# EAGLE schematic multiplexer (EAGLE 6.3)
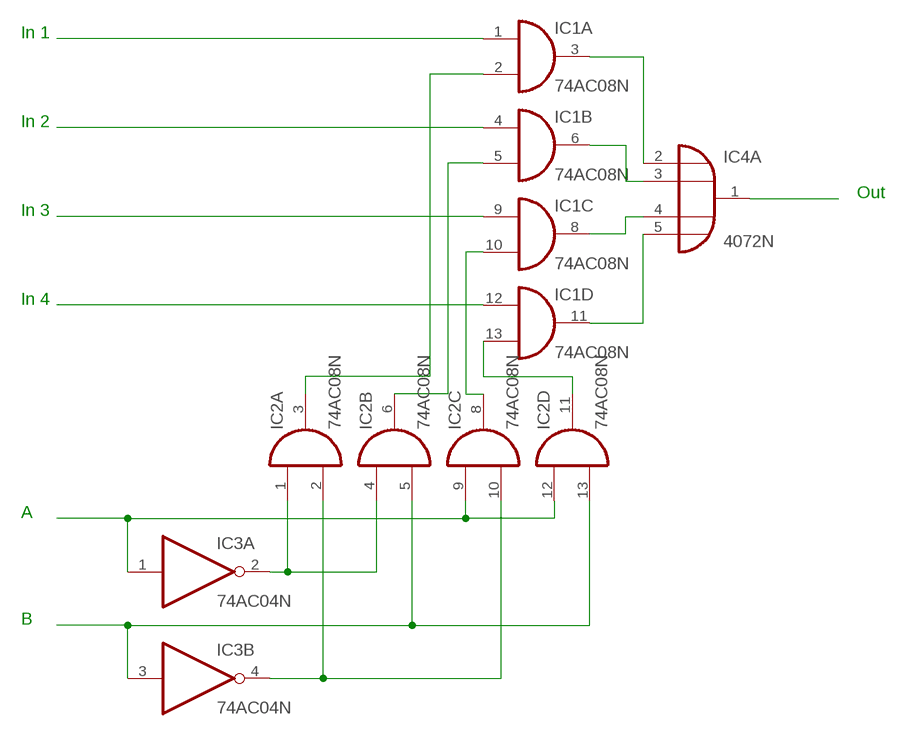
[diagram p0: schematic, sheet 1]

## Parts
IC1  74AC08N  [DIL14]
IC2  74AC08N  [DIL14]
IC3  74AC04N  [DIL14]
IC4  4072N  [DIL14]

## Nets
N$1: IC2.5(B:I1) IC2.13(D:I1) IC3.3(B:I)
N$2: IC1.13(D:I1) IC2.11(D:O)
N$3: IC1.10(C:I1) IC2.8(C:O)
N$4: IC1.5(B:I1) IC2.6(B:O)
N$5: IC1.2(A:I1) IC2.3(A:O)
N$6: IC2.9(C:I0) IC2.12(D:I0) IC3.1(A:I)
N$7: IC1.8(C:O) IC4.4(A:I2)
N$8: IC2.1(A:I0) IC2.4(B:I0) IC3.2(A:O)
N$9: IC2.2(A:I1) IC2.10(C:I1) IC3.4(B:O)
N$10: IC1.3(A:O) IC4.2(A:I0)
N$11: IC1.4(B:I0)
N$12: IC1.6(B:O) IC4.3(A:I1)
N$13: IC1.11(D:O) IC4.5(A:I3)
N$14: IC1.9(C:I0)
N$15: IC1.1(A:I0)
N$16: IC1.12(D:I0)
N$17: IC4.1(A:O)
Unconnected: IC3.5(C:I) IC3.6(C:O) IC3.8(D:O) IC3.9(D:I) IC3.10(E:O) IC3.11(E:I) IC3.12(F:O) IC3.13(F:I) IC4.9(B:I0) IC4.10(B:I1) IC4.11(B:I2) IC4.12(B:I3) IC4.13(B:O)

## Notes on the sheet
- In 1
- In 2
- Out
- In 3
- In 4
- A
- B

## Power pins joined to a net without a drawn wire
GND: IC1.7(P:GND) IC2.7(P:GND) IC3.7(P:GND)
VCC: IC1.14(P:VCC) IC2.14(P:VCC) IC3.14(P:VCC)
VDD: IC4.14(P:VDD)
VSS: IC4.7(P:VSS)

## Library data of the parts
IC1 IC2 = 74xx-eu:74*08: Quad 2-input AND gate
IC3 = 74xx-eu:74*04: Hex INVERTER
IC4 = 40xx:4072: Dual 4-input OR